# Altium project TactileSens_20x10.PrjPcb
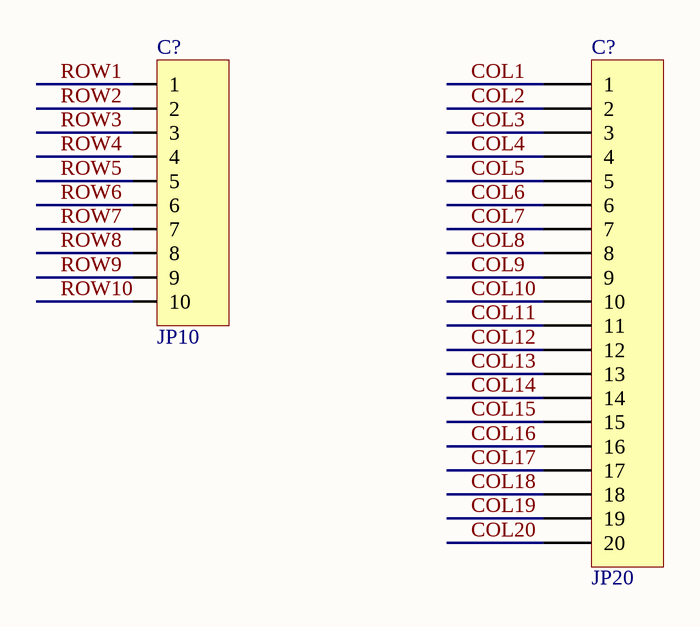
[diagram p0: TactileSens_20x10.SchDoc]
1 sheet, 2 parts. Net scope: global (net labels, ports and power ports of the same name join across sheets).
Board file: TactileSens_20x10.PcbDoc

## Sheet TactileSens_20x10.SchDoc
size A; SheetNumber: 1; SheetTotal: 1

### Parts
(Parts that share a designator on the sheet are numbered #1, #2 ... from top to bottom, then left to right.)
C?#1  JP20  [JP20-C1T]
C?#2  JP10  [JP10-C1T]

### Nets
COL1: C?#1.1
COL2: C?#1.2
COL3: C?#1.3
COL4: C?#1.4
COL5: C?#1.5
COL6: C?#1.6
COL7: C?#1.7
COL8: C?#1.8
COL9: C?#1.9
COL10: C?#1.10
COL11: C?#1.11
COL12: C?#1.12
COL13: C?#1.13
COL14: C?#1.14
COL15: C?#1.15
COL16: C?#1.16
COL17: C?#1.17
COL18: C?#1.18
COL19: C?#1.19
COL20: C?#1.20
ROW1: C?#2.1
ROW2: C?#2.2
ROW3: C?#2.3
ROW4: C?#2.4
ROW5: C?#2.5
ROW6: C?#2.6
ROW7: C?#2.7
ROW8: C?#2.8
ROW9: C?#2.9
ROW10: C?#2.10

### Library data of the parts
C?#1 = JP20: WR-PHD 2.54 mm Angled Socket Header; Manufacturer: W¨¹rth Elektronik eiSos GmbH; partNo: 613020143121; ComponentLink1 Description: Manufacturer; ComponentLink2 Description: Datasheet; NoPins: 20; Created Date: 29 March 2013; ComponentLink1URL: http://www.we-online.com; ComponentLink2URL: http://katalog.we-online.de/em/datasheet/6130xx143121.pdf; Created by: Karrer Zheng
C?#2 = JP10: WR-PHD 2.54 mm Angled Socket Header; Manufacturer: W¨¹rth Elektronik eiSos GmbH; partNo: 613010143121; ComponentLink1 Description: Manufacturer; ComponentLink2 Description: Datasheet; NoPins: 10; Created Date: 29 March 2013; ComponentLink1URL: http://www.we-online.com; ComponentLink2URL: http://katalog.we-online.de/em/datasheet/6130xx143121.pdf; Created by: Karrer Zheng